# Altium schematic sheet AudioInOut.SchDoc
size Tabloid; SheetNumber: 2; SheetTotal: 2
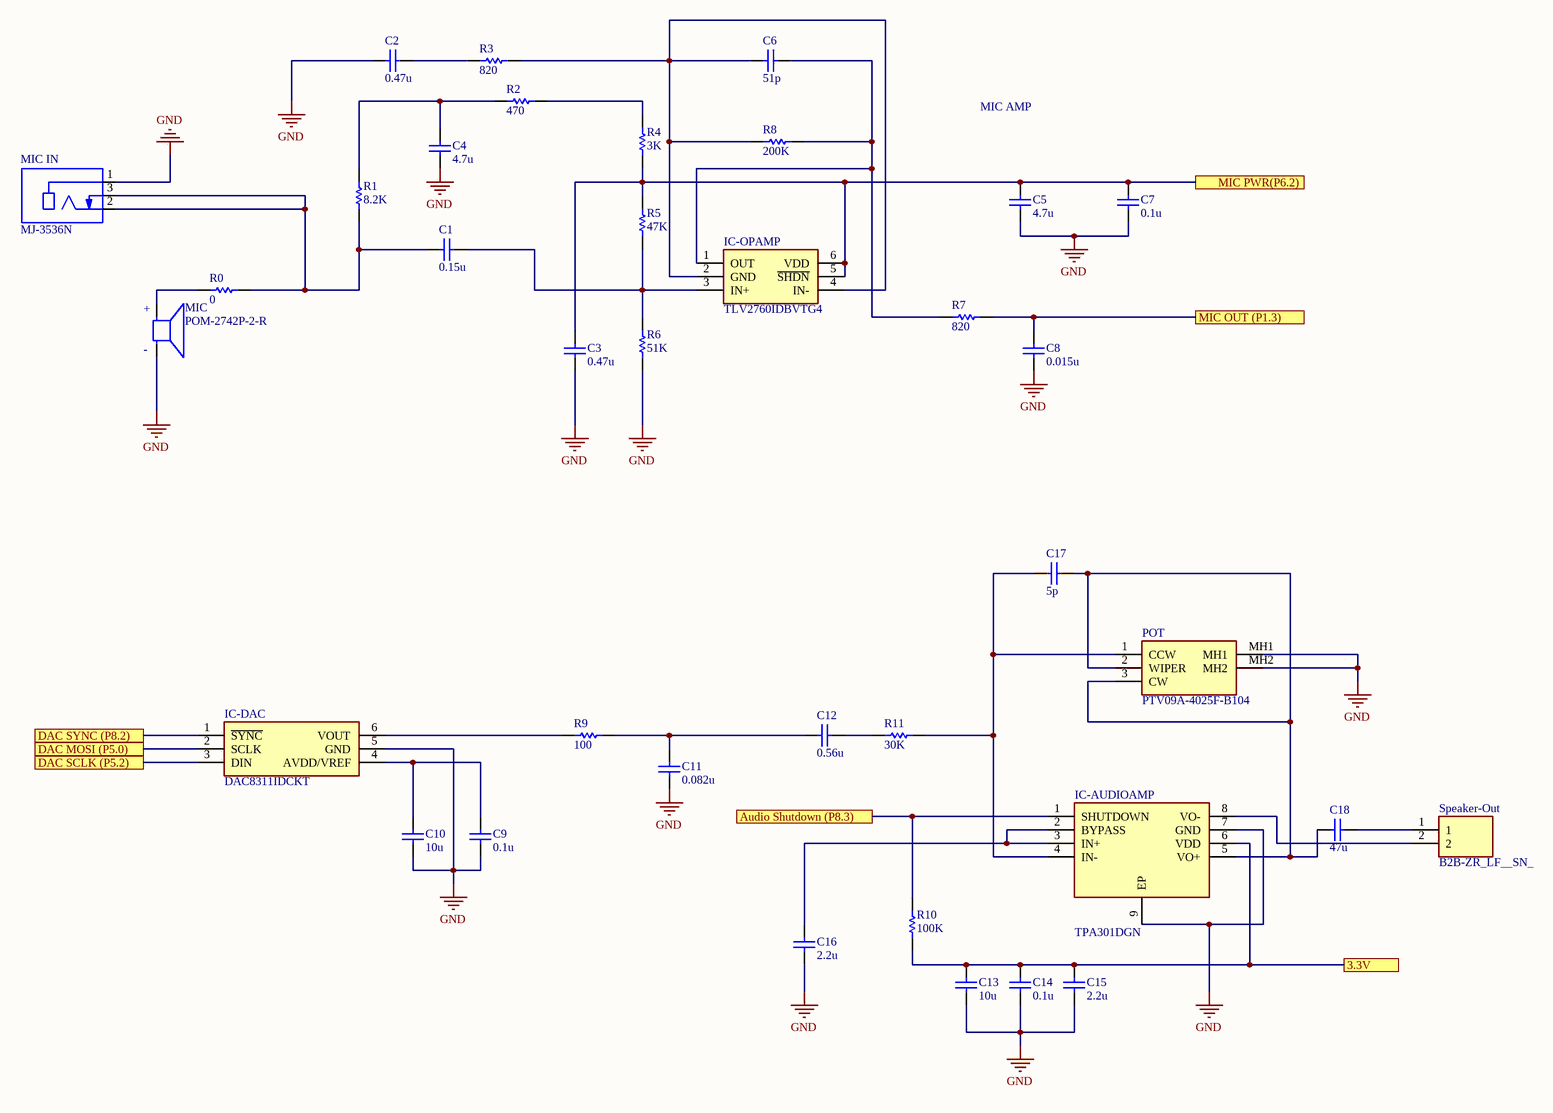
[diagram p0: AudioInOut.SchDoc]

## Parts
C1  0.15u  [CAPC1206(3216)170_M]
C2  0.47u  [CAPC1206(3216)170_M]
C3  0.47u  [CAPC1206(3216)170_M]
C4  4.7u  [CAPC1206(3216)170_M]
C5  4.7u  [CAPC1206(3216)170_M]
C6  51p  [CAPC1206(3216)170_M]
C7  0.1u  [CAPC1206(3216)170_M]
C8  0.015u  [CAPC1206(3216)170_M]
C9  0.1u  [CAPC1206(3216)170_M]
C10  10u  [CAPC1206(3216)170_M]
C11  0.082u  [CAPC1206(3216)170_M]
C12  0.56u  [CAPC1206(3216)170_M]
C13  10u  [CAPC1206(3216)170_M]
C14  0.1u  [CAPC1206(3216)170_M]
C15  2.2u  [CAPC1206(3216)170_M]
C16  2.2u  [CAPC1206(3216)170_M]
C17  5p  [CAPC1206(3216)170_M]
C18  47u  [CAPC1206(3216)170_M]
IC-AUDIOAMP  TPA301DGN  [SOP65P490X110-9N]
IC-DAC  DAC8311IDCKT  [SOT65P210X110-6N]
IC-OPAMP  TLV2760IDBVTG4  [SOT95P280X145-6N]
MIC  POM-2742P-2-R  [MIC_POM-2742P-2-R]
MIC_IN  MJ-3536N  [CUI_MJ-3536N]
POT  PTV09A-4025F-B104  [PTV09A4025FB104]
R0  0  [RESC3216X60X45NL10T20]
R1  8.2K  [RESC3216X60X45NL10T20]
R2  470  [RESC3216X60X45NL10T20]
R3  820  [RESC3216X60X45NL10T20]
R4  3K  [RESC3216X70X50LL05T20]
R5  47K  [RESC3216X60X45LL10T20]
R6  51K  [RESC3216X70X50NL20T25]
R7  820  [RESC3216X60X45NL10T20]
R8  200K  [RESC3216X60X45NL10T20]
R9  100  [RESC3216X60X45NL10T20]
R10  100K  [RESC3216X60X45NL10T20]
R11  30K  [RESC3216X60X45NL10T20]
Speaker-Out  B2B-ZR_LF__SN_  [SHDR2W50P0X150_1X2_450X350X450P]

## Ports
3.3V, Audio Shutdown (P8.3), DAC MOSI (P5.0), DAC SCLK (P5.2), DAC SYNC (P8.2), MIC OUT (P1.3), MIC PWR(P6.2)

## Nets
GND: C2.1 C3.2 C4.2 C5.2 C7.2 C8.2 C9.2 C10.2 C11.2 C13.2 C14.2 C15.2 C16.2 IC-AUDIOAMP.7(GND) IC-AUDIOAMP.9(EP) IC-DAC.5(GND) MIC.N(NEG) MIC_IN.1 POT.MH1 POT.MH2 R6.1
3.3V: C13.1 C14.1 C15.1 IC-AUDIOAMP.6(VDD) R10.1 ; port 3.3V
Audio Shutdown (P8.3): IC-AUDIOAMP.1(SHUTDOWN) R10.2 ; port Audio Shutdown (P8.3)
DAC MOSI (P5.0): IC-DAC.2(SCLK) ; port DAC MOSI (P5.0)
DAC SCLK (P5.2): IC-DAC.3(DIN) ; port DAC SCLK (P5.2)
DAC SYNC (P8.2): IC-DAC.1(~{SYNC}) ; port DAC SYNC (P8.2)
MIC OUT (P1.3): C8.1 R7.1 ; port MIC OUT (P1.3)
MIC PWR(P6.2): C3.1 C5.1 C7.1 IC-OPAMP.5(~{SHDN}) IC-OPAMP.6(VDD) R4.1 R5.2 ; port MIC PWR(P6.2)
NetC1_1: C1.1 MIC_IN.2 MIC_IN.3 R0.1 R1.1
NetC1_2: C1.2 IC-OPAMP.3(IN+) R5.1 R6.2
NetC2_2: C2.2 R3.1
NetC4_1: C4.1 R1.2 R2.1
NetC6_1: C6.1 IC-OPAMP.2(GND) IC-OPAMP.4(IN-) R3.2 R8.1
NetC6_2: C6.2 IC-OPAMP.1(OUT) R7.2 R8.2
NetC9_1: C9.1 C10.1 IC-DAC.4(AVDD/VREF)
NetC11_1: C11.1 C12.1 R9.2
NetC12_2: C12.2 R11.1
NetC16_1: C16.1 IC-AUDIOAMP.2(BYPASS) IC-AUDIOAMP.3(IN+)
NetC17_1: C17.1 IC-AUDIOAMP.4(IN-) POT.1(CCW) R11.2
NetC17_2: C17.2 C18.1 IC-AUDIOAMP.5(VO+) POT.2(WIPER) POT.3(CW)
NetC18_2: C18.2 Speaker-Out.1
NetIC-AUDIOAMP_8: IC-AUDIOAMP.8(VO-) Speaker-Out.2
NetIC-DAC_6: IC-DAC.6(VOUT) R9.1
NetMIC_P: MIC.P(POS) R0.2
NetR2_2: R2.2 R4.2

## Notes on the sheet
- MIC AMP
- (in symbol POM-2742P-2-R) +; -

## Library data of the parts
C1-C18 = CMP-1037-03299-1: CAP 6.8nF 50V ±10% 1206 (3216 Metric) Thickness 1.7mm SMD; Tolerance: Â±10%; Case-EIA: 1206; Case-Metric: 3216; Value: 6.8nF; Technology: SMT; Rated Voltage: 50 V; Max Thickness: 1.7 mm
IC-AUDIOAMP = TPA301DGN: Integrated Circuit; Manufacturer_Name: Texas Instruments; Datasheet Link: http://www.ti.com/lit/gpn/tpa301; Height: 1.1mm; Mouser2 Part Number: 595-TPA301DGN; Mouser2 Price/Stock: https://www.mouser.com/Search/Refine.aspx?Keyword=595-TPA301DGN; Manufacturer_Part_Number: TPA301DGN
IC-DAC = DAC8311IDCKT: Integrated Circuit; Manufacturer_Name: Texas Instruments; Datasheet Link: http://www.ti.com/lit/gpn/dac8311; Height: 1.1mm; Mouser2 Part Number: 595-DAC8311IDCKT; Mouser2 Price/Stock: https://www.mouser.com/Search/Refine.aspx?Keyword=595-DAC8311IDCKT; Manufacturer_Part_Number: DAC8311IDCKT
IC-OPAMP = TLV2760IDBVTG4: Integrated Circuit; Manufacturer_Name: Texas Instruments; Datasheet Link: https://www.ti.com/lit/ds/symlink/tlv2760.pdf?ts=1637756368752&ref_url=https%253A%252F%252Fwww.google.com%252F; Height: 1.45mm; Mouser2 Part Number: 595-TLV2760IDBVTG4; Mouser2 Price/Stock: https://www.mouser.com/Search/Refine.aspx?Keyword=595-TLV2760IDBVTG4; Manufacturer_Part_Number: TLV2760IDBVTG4
MIC = POM-2742P-2-R: ELECTRET CONDENSER MICROPHONE 6MM DIA; MF: PUI Audio; Package: None; Purchase-URL: https://pricing.snapeda.com/search/part/POM-2742P-2-R/?ref=eda; Value: *; Digi-Key_Part_Number: 668-1160-ND; SnapEDA_Link: https://www.snapeda.com/parts/POM-2742P-2-R/PUI+Audio/view-part/?ref=snap; MP: POM-2742P-2-R; Check_prices: https://www.snapeda.com/parts/POM-2742P-2-R/PUI+Audio/view-part/?ref=eda
MIC_IN = MJ-3536N: 3.5 mm, Mono, Right Angle, Through Hole, Audio Jack Connector; MF: CUI Devices; MP: MJ-3536N; Availability: Unavailable; Package: None; SnapEDA_Link: https://www.snapeda.com/parts/MJ-3536N/CUI%20Devices/view-part/559067/?ref=snap; Price: None; Value: *
POT = PTV09A-4025F-B104: Variable Resistor; Manufacturer_Name: Bourns; Datasheet Link: https://componentsearchengine.com//PTV09A-4025F-B104.pdf; Height: 25.5mm; Mouser2 Part Number: 652-PTV09A4025FB104; Mouser2 Price/Stock: https://www.mouser.com/Search/Refine.aspx?Keyword=652-PTV09A4025FB104; Manufacturer_Part_Number: PTV09A-4025F-B104
R0-R3 R7-R11 = CMP-1014-00812-2: Part Number: CRCW1206470KFKEA; Manufacturer: Vishay Dale
R4 = CMP-1014-00562-2: Manufacturer: Panasonic; Part Number: ERJ8ENF3001V
R5 = CMP-2003-02213-1: Part Number: CRCW120647K0FKEA; Manufacturer: Vishay Dale
R6 = CMP-2003-04477-1: Manufacturer: Panasonic; Part Number: ERA8AEB513V
Speaker-Out = B2B-ZR_LF__SN_: Connector; Manufacturer_Name: JST (JAPAN SOLDERLESS TERMINALS); Manufacturer_Part_Number: B2B-ZR(LF)(SN); Datasheet Link: https://componentsearchengine.com/Datasheets/2/B2B-ZR(LF)(SN).pdf; Height: 4.5mm; Arrow Part Number: B2B-ZR(LF)(SN); Arrow Price/Stock: https://www.arrow.com/en/products/b2b-zr-lf-sn/jst-manufacturing